# Altium project BigCreteCAN.PrjPcb
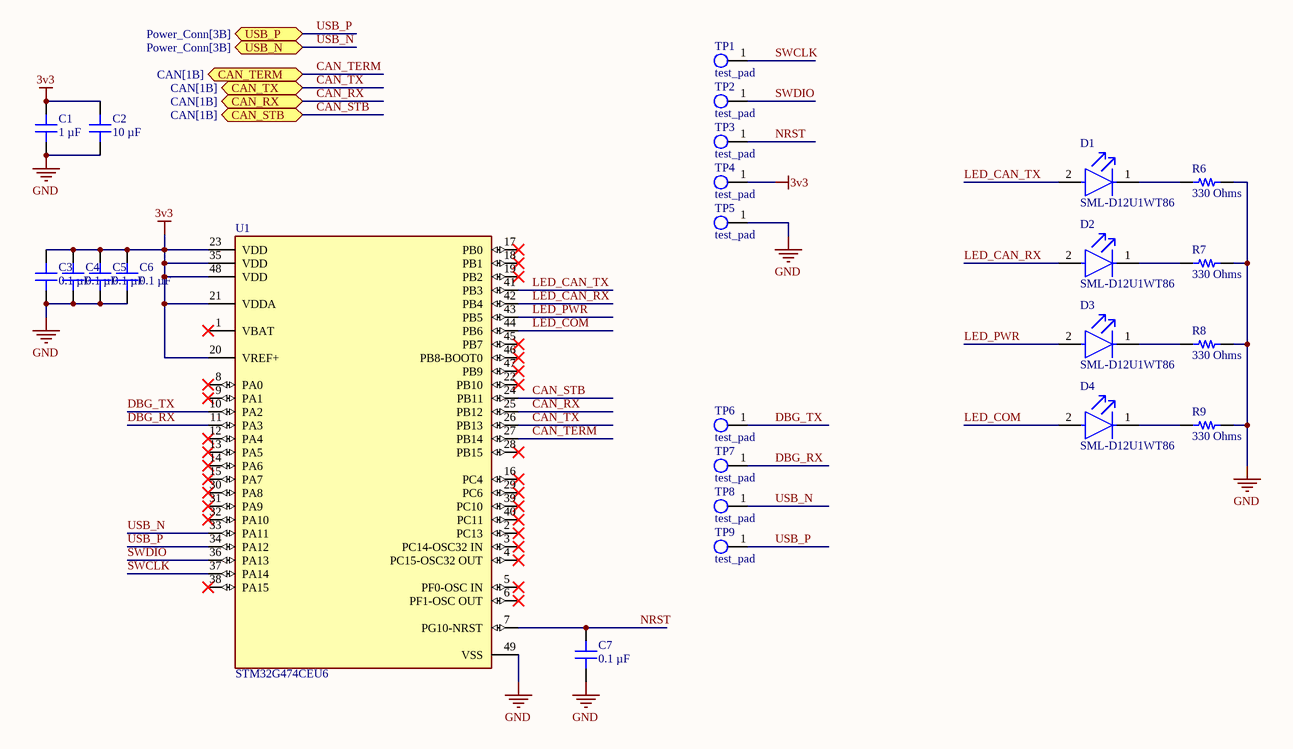
[diagram p0: Microcontroller.SchDoc]
3 sheets, 47 parts. Net scope: flat (ports and power ports of the same name join across sheets).
Board file: BigCreteCANV1.PcbDoc
Sheets:
  Microcontroller.SchDoc
  Power_Conn.SchDoc
  CAN.SchDoc

## Sheet Microcontroller.SchDoc
size A4; SheetNumber: 1; SheetTotal: 3

### Parts
C1  1 µF  [CAP 0603_1608]
C2  10 µF  [CAP 0805_2012]
C3  0.1 µF  [CAP 0603_1608]
C4  0.1 µF  [CAP 0603_1608]
C5  0.1 µF  [CAP 0603_1608]
C6  0.1 µF  [CAP 0603_1608]
C7  0.1 µF  [CAP 0603_1608]
D1  SML-D12U1WT86  [FP-SML-D12-MFG]
D2  SML-D12U1WT86  [FP-SML-D12-MFG]
D3  SML-D12U1WT86  [FP-SML-D12-MFG]
D4  SML-D12U1WT86  [FP-SML-D12-MFG]
R6  330 Ohms  [RES 0603_1608]
R7  330 Ohms  [RES 0603_1608]
R8  330 Ohms  [RES 0603_1608]
R9  330 Ohms  [RES 0603_1608]
TP1  test_pad  [2mm TP]
TP2  test_pad  [2mm TP]
TP3  test_pad  [2mm TP]
TP4  test_pad  [2mm TP]
TP5  test_pad  [2mm TP]
TP6  test_pad  [2mm TP]
TP7  test_pad  [2mm TP]
TP8  test_pad  [2mm TP]
TP9  test_pad  [2mm TP]
U1  STM32G474CEU6  [FP-UFQFPN48-A0B9-IPC_C]

### Ports
CAN_RX (bidir, see CAN[1B]), CAN_STB (bidir, see CAN[1B]), CAN_TERM (bidir, see CAN[1B]), CAN_TX (bidir, see CAN[1B]), USB_N (bidir, see Power_Conn[3B]), USB_P (bidir, see Power_Conn[3B])

### Nets
3v3: C1.2 C2.2 C3.2 C4.2 C5.2 C6.2 TP4.1 U1.20(VREF+) U1.21(VDDA) U1.23(VDD) U1.35(VDD) U1.48(VDD)
GND: C1.1 C2.1 C3.1 C4.1 C5.1 C6.1 C7.1 R6.1 R7.1 R8.1 R9.1 TP5.1 U1.49(VSS)
CAN_RX: U1.25(PB12) ; port CAN_RX
CAN_STB: U1.24(PB11) ; port CAN_STB
CAN_TERM: U1.27(PB14) ; port CAN_TERM
CAN_TX: U1.26(PB13) ; port CAN_TX
DBG_RX: TP7.1 U1.11(PA3)
DBG_TX: TP6.1 U1.10(PA2)
LED_CAN_RX: D2.2(A) U1.42(PB4)
LED_CAN_TX: D1.2(A) U1.41(PB3)
LED_COM: D4.2(A) U1.44(PB6)
LED_PWR: D3.2(A) U1.43(PB5)
NRST: C7.2 TP3.1 U1.7(PG10-NRST)
SWCLK: TP1.1 U1.37(PA14)
SWDIO: TP2.1 U1.36(PA13)
USB_N: TP8.1 U1.33(PA11) ; port USB_N
USB_P: TP9.1 U1.34(PA12) ; port USB_P
NetD1_1: D1.1(C) R6.2
NetD2_1: D2.1(C) R7.2
NetD3_1: D3.1(C) R8.2
NetD4_1: D4.1(C) R9.2

Not connected (* = marked no-connect by the designer): U1 1(VBAT)* 2(PC13)* 3(PC14-OSC32_IN)* 4(PC15-OSC32_OUT)* 5(PF0-OSC_IN)* 6(PF1-OSC_OUT)* 8(PA0)* 9(PA1)* 12(PA4)* 13(PA5)* 14(PA6)* 15(PA7)* 16(PC4)* 17(PB0)* 18(PB1)* 19(PB2)* 22(PB10)* 28(PB15)* 29(PC6)* 30(PA8)* 31(PA9)* 32(PA10)* 38(PA15)* 39(PC10)* 40(PC11)* 45(PB7)* 46(PB8-BOOT0)* 47(PB9)*

### Library data of the parts
C1 = CL10B105KP8NFNC: CAP CER 1UF 10V X7R 0603; manufacturer: Samsung Electro-Mechanics; Tolerance: ±10%; Part Number: CL10B105KP8NFNC; Value: 1 µF; Applications: General Purpose; Capacitance: 1 µF; componentlink1description: Datasheet; componentlink1url: http://www.samsungsem.com/kr/support/product-search/mlcc/CL10B105KP8NFNC.jsp; componentlink2description: DigiKey Link; componentlink2url: https://www.digikey.com/en/products/detail/samsung-electro-mechanics/CL10B105KP8NFNC/3887603; Device Package: 0603 (1608 Metric); lastupdated: 2023-11-08 8:08:57 PM; Lifecycle Status: Active; Minimum Order: 1; Mounting Type: Surface Mount, MLCC; Operating Temperature: -55°C ~ 125°C; Package / Case: 0603 (1608 Metric); packaging: TapeAndReel; partid: 10019; Part Status: Active; price: 0.01; series: CL; Size / Dimension: 0.063" L x 0.031" W (1.60mm x 0.80mm); Supplier 1: DigiKey; Supplier Part Number 1: 1276-1945-1-ND; Temperature Coefficient: X7R; Thickness (Max): 0.035" (0.90mm); Voltage - Rated: 10V
C2 = CL21A106KOQNNNE: CAP CER 10UF 16V X5R 0805; manufacturer: Samsung Electro-Mechanics; Tolerance: ±10%; Part Number: CL21A106KOQNNNE; Value: 10 µF; Applications: General Purpose; Capacitance: 10 µF; componentlink1description: Datasheet; componentlink1url: http://www.samsungsem.com/kr/support/product-search/mlcc/CL21A106KOQNNNE.jsp; componentlink2description: DigiKey Link; componentlink2url: https://www.digikey.com/en/products/detail/samsung-electro-mechanics/CL21A106KOQNNNE/3886754; Device Package: 0805 (2012 Metric); lastupdated: 2023-11-08 8:12:18 PM; Lifecycle Status: Active; Minimum Order: 1; Mounting Type: Surface Mount, MLCC; Operating Temperature: -55°C ~ 85°C; Package / Case: 0805 (2012 Metric); packaging: TapeAndReel; partid: 14297; Part Status: Active; price: 0.01; series: CL; Size / Dimension: 0.079" L x 0.049" W (2.00mm x 1.25mm); Supplier 1: DigiKey; Supplier Part Number 1: 1276-1096-1-ND; Temperature Coefficient: X5R; Thickness (Max): 0.055" (1.40mm); Voltage - Rated: 16V
C3-C7 = CL10B104KB8NNNC: CAP CER 0.1UF 50V X7R 0603; manufacturer: Samsung Electro-Mechanics; Tolerance: ±10%; Part Number: CL10B104KB8NNNC; Value: 0.1 µF; Applications: General Purpose; Capacitance: 0.1 µF; componentlink1description: Datasheet; componentlink1url: http://www.samsungsem.com/kr/support/product-search/mlcc/CL10B104KB8NNNC.jsp; componentlink2description: DigiKey Link; componentlink2url: https://www.digikey.com/en/products/detail/samsung-electro-mechanics/CL10B104KB8NNNC/3886658; Device Package: 0603 (1608 Metric); lastupdated: 2023-11-08 8:08:57 PM; Lifecycle Status: Active; Minimum Order: 1; Mounting Type: Surface Mount, MLCC; Operating Temperature: -55°C ~ 125°C; Package / Case: 0603 (1608 Metric); packaging: TapeAndReel; partid: 9788; Part Status: Active; price: 0.01; series: CL; Size / Dimension: 0.063" L x 0.031" W (1.60mm x 0.80mm); Supplier 1: DigiKey; Supplier Part Number 1: 1276-1000-1-ND; Temperature Coefficient: X7R; Thickness (Max): 0.035" (0.90mm); Voltage - Rated: 50V
D1-D4 = CMP-08952-000009-1: LED RED DIFFUSED 1608 SMD; Manufacturer: Rohm; Led Orientation: Top View; Power Dissipation: 54mW; Forward Current: 20mA; Wavelength: 620nm; Reverse Voltage: 5V; Luminous Intensity: 63mcd; Forward Voltage: 2.2V; Description: Red 620nm LED Indication - Discrete 2.2V 0603 (1608 Metric); Mouser Description: SML-D12 Series Red 0603 Diffused 63 mcd 2.2 V Surface Mount LED; Temperature: -40°C to +85°C; Device Class L2: LEDs; Lead Free: Yes; Automotive: No; Octopart: https://octopart.com/sml-d12u1wt86-rohm-70850259; RoHS: TRUE; Colour: Red; Digikey Description: LED RED DIFFUSED 1608 SMD; Package: SML-D12; Device Class L1: Optoelectronics; Category: Diode; Temperature Range High: +85°C; Height: 0.65mm; ComponentLink2Description: Datasheet; Temperature Range Low: -40°C; ComponentLink2URL: https://www.rohm.com/datasheet/SML-D12U1W/sml-d12x1-e; Manufacturer Part Number: SML-D12U1WT86; Device Class L3: unset
R6-R9 = CR0603-JW-331ELF: RES SMD 330 OHM 5% 1/10W 0603; Manufacturer: Bourns Inc.; Power (Watts): 0.1W, 1/10W; Temperature Coefficient: ±200ppm/°C; Part Number: CR0603-JW-331ELF; Value: 330 Ohms; ComponentLink1Description: Datasheet; ComponentLink1URL: https://www.bourns.com/docs/Product-Datasheets/CHPREZTR.pdf; ComponentLink2Description: DigiKey Link; ComponentLink2URL: https://www.digikey.com/en/products/detail/bourns-inc/CR0603-JW-331ELF/2345095; Composition: Thick Film; Device Package: 0603 (1608 Metric); Features: Moisture Resistant; Height - Seated (Max): 0.022" (0.55mm); LastUpdated: 2023-11-08 8:34:22 PM; Lifecycle Status: Active; Minimum Order: 1; Number of Terminations: 2; Operating Temperature: -55°C ~ 155°C; Package / Case: 0603 (1608 Metric); Packaging: CutTape; PartId: 25660; Part Status: Active; Price: 0.01; Resistance: 330 Ohms; Series: CR0603; Size / Dimension: 0.063" L x 0.031" W (1.60mm x 0.80mm); Supplier 1: DigiKey; Supplier Part Number 1: CR0603-JW-331ELFCT-ND; Supplier Device Package: 0603; Tolerance: ±5%
TP1-TP9 = test_pad: Test pad for ICT
U1 = CMP-12105-000082-1: MAINSTREAM ARM CORTEX-M4 CORE WI

## Sheet Power_Conn.SchDoc
size A4; SheetNumber: 2; SheetTotal: 3
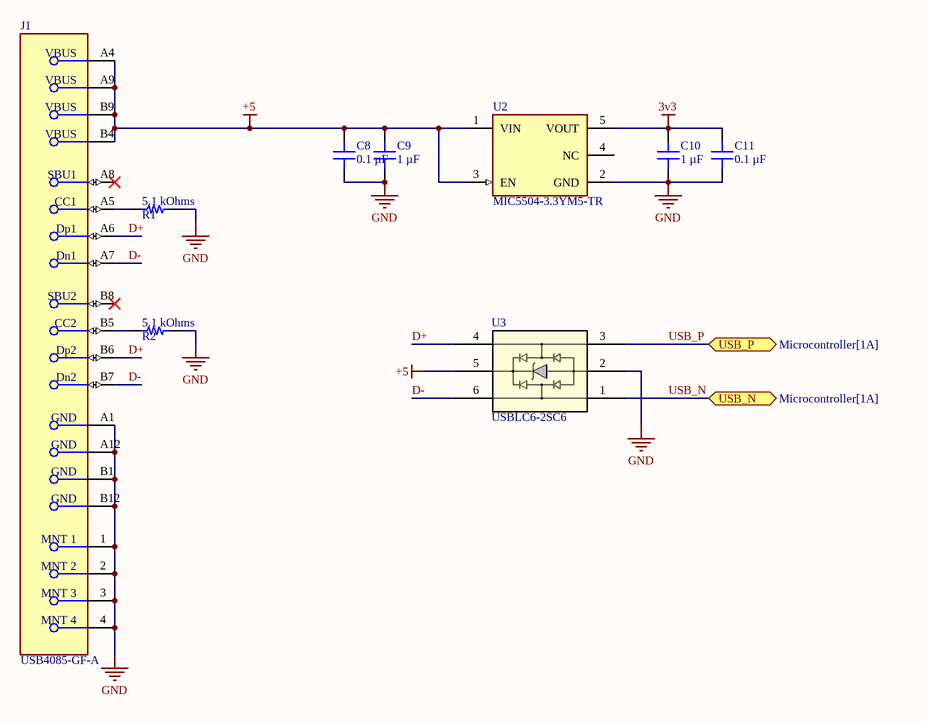
[diagram p1: Power_Conn.SchDoc]

### Parts
C8  0.1 µF  [CAP 0603_1608]
C9  1 µF  [CAP 0603_1608]
C10  1 µF  [CAP 0603_1608]
C11  0.1 µF  [CAP 0603_1608]
J1  USB4085-GF-A  [FP-USB4085-GF-A-MFG]
R1  5.1 kOhms  [RES 0805_2012]
R2  5.1 kOhms  [RES 0805_2012]
U2  MIC5504-3.3YM5-TR  [FP-SOT23-5LD-PL-1-MFG]
U3  USBLC6-2SC6  [SOT23-6L_STM]

### Ports
USB_N (bidir, see Microcontroller[1A]), USB_P (bidir, see Microcontroller[1A])

### Nets
3v3: C10.2 C11.2 U2.5(VOUT)
+5: C8.2 C9.2 J1.A4(VBUS) J1.A9(VBUS) J1.B4(VBUS) J1.B9(VBUS) U2.1(VIN) U2.3(EN) U3.5
GND: C8.1 C9.1 C10.1 C11.1 J1.1(MNT_1) J1.2(MNT_2) J1.3(MNT_3) J1.4(MNT_4) J1.A1(GND) J1.A12(GND) J1.B1(GND) J1.B12(GND) R1.2 R2.2 U2.2(GND) U3.2
D+: J1.A6(Dp1) J1.B6(Dp2) U3.4
D-: J1.A7(Dn1) J1.B7(Dn2) U3.6
USB_N: U3.1 ; port USB_N
USB_P: U3.3 ; port USB_P
NetJ1_A5: J1.A5(CC1) R1.1
NetJ1_B5: J1.B5(CC2) R2.1

Not connected (* = marked no-connect by the designer): J1 A8(SBU1)* B8(SBU2)*; U2 4(NC)

### Library data of the parts
C8 C11 = CL10B104KB8NNNC: as C3 on sheet Microcontroller; Part Number: CL10B104KB8NNNC; Value: 0.1 µF; Applications: General Purpose; Capacitance: 0.1 µF; componentlink1description: Datasheet; componentlink1url: http://www.samsungsem.com/kr/support/product-search/mlcc/CL10B104KB8NNNC.jsp; componentlink2description: DigiKey Link; componentlink2url: https://www.digikey.com/en/products/detail/samsung-electro-mechanics/CL10B104KB8NNNC/3886658; Device Package: 0603 (1608 Metric); lastupdated: 2023-11-08 8:08:57 PM; Lifecycle Status: Active; Minimum Order: 1; Mounting Type: Surface Mount, MLCC; Operating Temperature: -55°C ~ 125°C; Package / Case: 0603 (1608 Metric); packaging: TapeAndReel; partid: 9788; Part Status: Active; price: 0.01; series: CL; Size / Dimension: 0.063" L x 0.031" W (1.60mm x 0.80mm); Supplier 1: DigiKey; Supplier Part Number 1: 1276-1000-1-ND; Temperature Coefficient: X7R; Thickness (Max): 0.035" (0.90mm); Voltage - Rated: 50V
C9 C10 = CL10B105KP8NFNC: as C1 on sheet Microcontroller; Part Number: CL10B105KP8NFNC; Value: 1 µF; Applications: General Purpose; Capacitance: 1 µF; componentlink1description: Datasheet; componentlink1url: http://www.samsungsem.com/kr/support/product-search/mlcc/CL10B105KP8NFNC.jsp; componentlink2description: DigiKey Link; componentlink2url: https://www.digikey.com/en/products/detail/samsung-electro-mechanics/CL10B105KP8NFNC/3887603; Device Package: 0603 (1608 Metric); lastupdated: 2023-11-08 8:08:57 PM; Lifecycle Status: Active; Minimum Order: 1; Mounting Type: Surface Mount, MLCC; Operating Temperature: -55°C ~ 125°C; Package / Case: 0603 (1608 Metric); packaging: TapeAndReel; partid: 10019; Part Status: Active; price: 0.01; series: CL; Size / Dimension: 0.063" L x 0.031" W (1.60mm x 0.80mm); Supplier 1: DigiKey; Supplier Part Number 1: 1276-1945-1-ND; Temperature Coefficient: X7R; Thickness (Max): 0.035" (0.90mm); Voltage - Rated: 10V
J1 = CMP-196119-000001-2: CONN RCPT USB2.0 TYPE C 24POS RA; Gender: Receptacle; Number of Positions: 16; USB Standard: USB 2.0; Orientation: Right Angle; Contact Plating: Gold; Contact Material: Copper Alloy
R1 R2 = RC0805JR-075K1L: RES 5.1K OHM 5% 1/8W 0805; Manufacturer: Yageo; Power (Watts): 0.125W, 1/8W; Temperature Coefficient: ±100ppm/°C; Part Number: RC0805JR-075K1L; Value: 5.1 kOhms; ComponentLink1Description: Datasheet; ComponentLink1URL: https://www.yageo.com/upload/media/product/productsearch/datasheet/rchip/PYu-RC_Group_51_RoHS_L_10.pdf; ComponentLink2Description: DigiKey Link; ComponentLink2URL: https://www.digikey.com/en/products/detail/yageo/RC0805JR-075K1L/728338; Composition: Thick Film; Device Package: 0805 (2012 Metric); Features: Moisture Resistant; Height - Seated (Max): 0.024" (0.60mm); LastUpdated: 2023-01-02 8:43:52 PM; Lifecycle Status: Active; Minimum Order: 1; Number of Terminations: 2; Operating Temperature: -55°C ~ 155°C; Package / Case: 0805 (2012 Metric); Packaging: CutTape; PartId: 41971; Part Status: Active; Price: 0.01; Resistance: 5.1 kOhms; Series: RC_L; Size / Dimension: 0.079" L x 0.049" W (2.00mm x 1.25mm); Supplier 1: DigiKey; Supplier Part Number 1: 311-5.1KARCT-ND; Supplier Device Package: 0805; Tolerance: ±5%
U2 = CMP-2000-07604-2: IC REG LINEAR 3.3V 300MA SOT23-5; Quiescent Current: 38uA; Operating Supply Current: 42uA; Max Input Voltage: 5.5V; Min Input Voltage: 2.5V; Output Type: Fixed; Power Supply Rejection Ratio (PSRR): 60dB; Dropout Voltage: 380mV; Accuracy: 3%; Number of Outputs: 1; Nominal Output Voltage: 3.3V; Max Output Current: 300mA; Length: 2.9mm; Mount: Surface Mount; Width: 1.6mm; Packaging: Tape and Reel; Output Current: 300mA; Min Operating Temperature: -40°C; Max Operating Temperature: 125°C; Height: 1.1mm; Case/Package: SOT-23-5; REACH SVHC: No SVHC; Number of Pins: 5; Output Voltage: 3.3V
U3 = USBLC6-2SC6: No Description Available; Mfr_Name: STMicroelectronics; Copyright: Copyright (C) 2023 Ultra Librarian. All rights reserved.; Manufacturer_Part_Number: USBLC6-2SC6; RefDes: RefDes; Type: DEV

## Sheet CAN.SchDoc
size A4; SheetNumber: 3; SheetTotal: 3
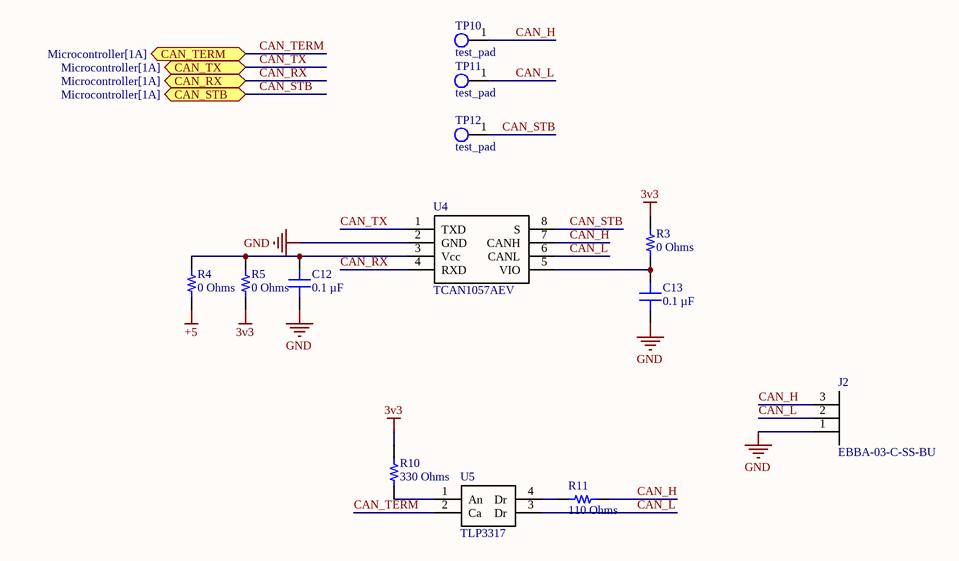
[diagram p2: CAN.SchDoc]

### Parts
C12  0.1 µF  [CAP 0603_1608]
C13  0.1 µF  [CAP 0603_1608]
J2  EBBA-03-C-SS-BU  [EBBA-03-C-SS-BU]
R3  0 Ohms  [RES 0603_1608]
R4  0 Ohms  [RES 0603_1608]
R5  0 Ohms  [RES 0603_1608]
R10  330 Ohms  [RES 0603_1608]
R11  110 Ohms  [RES 0603_1608]
TP10  test_pad  [2mm TP]
TP11  test_pad  [2mm TP]
TP12  test_pad  [2mm TP]
U4  TCAN1057AEV  [TCAN1057AEV]
U5  TLP3317  [TLP3317]

### Ports
CAN_RX (bidir, see Microcontroller[1A]), CAN_STB (bidir, see Microcontroller[1A]), CAN_TERM (bidir, see Microcontroller[1A]), CAN_TX (bidir, see Microcontroller[1A])

### Nets
3v3: R3.2 R5.1 R10.2
+5: R4.1
GND: C12.1 C13.1 J2.1 U4.2(GND)
CAN_H: J2.3 R11.1 TP10.1 U4.7(CANH)
CAN_L: J2.2 TP11.1 U4.6(CANL) U5.3(Dr)
CAN_RX: U4.4(RXD) ; port CAN_RX
CAN_STB: TP12.1 U4.8(S) ; port CAN_STB
CAN_TERM: U5.2(Ca) ; port CAN_TERM
CAN_TX: U4.1(TXD) ; port CAN_TX
NetC12_2: C12.2 R4.2 R5.2 U4.3(Vcc)
NetC13_2: C13.2 R3.1 U4.5(VIO)
NetR10_1: R10.1 U5.1(An)
NetR11_2: R11.2 U5.4(Dr)

### Library data of the parts
C12 C13 = CL10B104KB8NNNC: as C3 on sheet Microcontroller; Part Number: CL10B104KB8NNNC; Value: 0.1 µF; Applications: General Purpose; Capacitance: 0.1 µF; componentlink1description: Datasheet; componentlink1url: http://www.samsungsem.com/kr/support/product-search/mlcc/CL10B104KB8NNNC.jsp; componentlink2description: DigiKey Link; componentlink2url: https://www.digikey.com/en/products/detail/samsung-electro-mechanics/CL10B104KB8NNNC/3886658; Device Package: 0603 (1608 Metric); lastupdated: 2023-11-08 8:08:57 PM; Lifecycle Status: Active; Minimum Order: 1; Mounting Type: Surface Mount, MLCC; Operating Temperature: -55°C ~ 125°C; Package / Case: 0603 (1608 Metric); packaging: TapeAndReel; partid: 9788; Part Status: Active; price: 0.01; series: CL; Size / Dimension: 0.063" L x 0.031" W (1.60mm x 0.80mm); Supplier 1: DigiKey; Supplier Part Number 1: 1276-1000-1-ND; Temperature Coefficient: X7R; Thickness (Max): 0.035" (0.90mm); Voltage - Rated: 50V
J2 = EBBA-03-C-SS-BU: Screw Terminal
R3-R5 = RMCF0603ZT0R00: RES 0 OHM JUMPER 1/10W 0603; Manufacturer: Stackpole Electronics Inc; Power (Watts): 0.1W, 1/10W; Part Number: RMCF0603ZT0R00; Value: 0 Ohms; ComponentLink1Description: Datasheet; ComponentLink1URL: https://www.seielect.com/catalog/sei-rmcf_rmcp.pdf; ComponentLink2Description: DigiKey Link; ComponentLink2URL: https://www.digikey.com/en/products/detail/stackpole-electronics-inc/RMCF0603ZT0R00/1756908; Composition: Thick Film; Device Package: 0603 (1608 Metric); Features: Automotive AEC-Q200; Height - Seated (Max): 0.022" (0.55mm); LastUpdated: 2023-11-08 8:34:48 PM; Lifecycle Status: Active; Minimum Order: 1; Number of Terminations: 2; Operating Temperature: -55°C ~ 155°C; Package / Case: 0603 (1608 Metric); Packaging: CutTape; PartId: 22613; Part Status: Active; Price: 0.01; Ratings: AEC-Q200; Resistance: 0 Ohms; Series: RMCF; Size / Dimension: 0.061" L x 0.031" W (1.55mm x 0.80mm); Supplier 1: DigiKey; Supplier Part Number 1: RMCF0603ZT0R00CT-ND; Supplier Device Package: 0603; Tolerance: Jumper
R10 = CR0603-JW-331ELF: as R6 on sheet Microcontroller; Part Number: CR0603-JW-331ELF; Value: 330 Ohms; ComponentLink1Description: Datasheet; ComponentLink1URL: https://www.bourns.com/docs/Product-Datasheets/CHPREZTR.pdf; ComponentLink2Description: DigiKey Link; ComponentLink2URL: https://www.digikey.com/en/products/detail/bourns-inc/CR0603-JW-331ELF/2345095; Composition: Thick Film; Device Package: 0603 (1608 Metric); Features: Moisture Resistant; Height - Seated (Max): 0.022" (0.55mm); LastUpdated: 2023-11-08 8:34:22 PM; Lifecycle Status: Active; Minimum Order: 1; Number of Terminations: 2; Operating Temperature: -55°C ~ 155°C; Package / Case: 0603 (1608 Metric); Packaging: CutTape; PartId: 25660; Part Status: Active; Price: 0.01; Resistance: 330 Ohms; Series: CR0603; Size / Dimension: 0.063" L x 0.031" W (1.60mm x 0.80mm); Supplier 1: DigiKey; Supplier Part Number 1: CR0603-JW-331ELFCT-ND; Supplier Device Package: 0603; Tolerance: ±5%
R11 = RMCF0603FT110R: RES 110 OHM 1% 1/10W 0603; Manufacturer: Stackpole Electronics Inc; Power (Watts): 0.1W, 1/10W; Temperature Coefficient: ±100ppm/°C; Part Number: RMCF0603FT110R; Value: 110 Ohms; ComponentLink1Description: Datasheet; ComponentLink1URL: https://www.seielect.com/catalog/sei-packaging.pdf; ComponentLink2Description: DigiKey Link; ComponentLink2URL: https://www.digikey.com/en/products/detail/stackpole-electronics-inc/RMCF0603FT110R/1761268; Composition: Thick Film; Device Package: 0603 (1608 Metric); Features: Automotive AEC-Q200; Height - Seated (Max): 0.022" (0.55mm); LastUpdated: 2023-11-08 8:35:50 PM; Lifecycle Status: Active; Minimum Order: 1; Number of Terminations: 2; Operating Temperature: -55°C ~ 155°C; Package / Case: 0603 (1608 Metric); Packaging: CutTape; PartId: 6924; Part Status: Active; Price: 0.01; Ratings: AEC-Q200; Resistance: 110 Ohms; Series: RMCF; Size / Dimension: 0.061" L x 0.031" W (1.55mm x 0.80mm); Supplier 1: DigiKey; Supplier Part Number 1: RMCF0603FT110RCT-ND; Supplier Device Package: 0603; Tolerance: ±1%
TP10-TP12 = test_pad: Test pad for ICT

## Nets that join several sheets
3v3: Microcontroller (12 pins), Power_Conn (C10.2 C11.2 U2.5), CAN (R3.2 R5.1 R10.2)
+5: Power_Conn (9 pins), CAN (R4.1)
GND: Microcontroller (13 pins), Power_Conn (16 pins), CAN (C12.1 C13.1 J2.1 U4.2)
CAN_RX: Microcontroller (U1.25), CAN (U4.4)
CAN_STB: Microcontroller (U1.24), CAN (TP12.1 U4.8)
CAN_TERM: Microcontroller (U1.27), CAN (U5.2)
CAN_TX: Microcontroller (U1.26), CAN (U4.1)
USB_N: Microcontroller (TP8.1 U1.33), Power_Conn (U3.1)
USB_P: Microcontroller (TP9.1 U1.34), Power_Conn (U3.3)

## Assembly variants
5V CAN: not fitted R5 R6
3v3 CAN: not fitted R4